# Altium schematic sheet DiffAmp_K-0.2.SchDoc
size A3; SheetNumber: 5; SheetTotal: 8
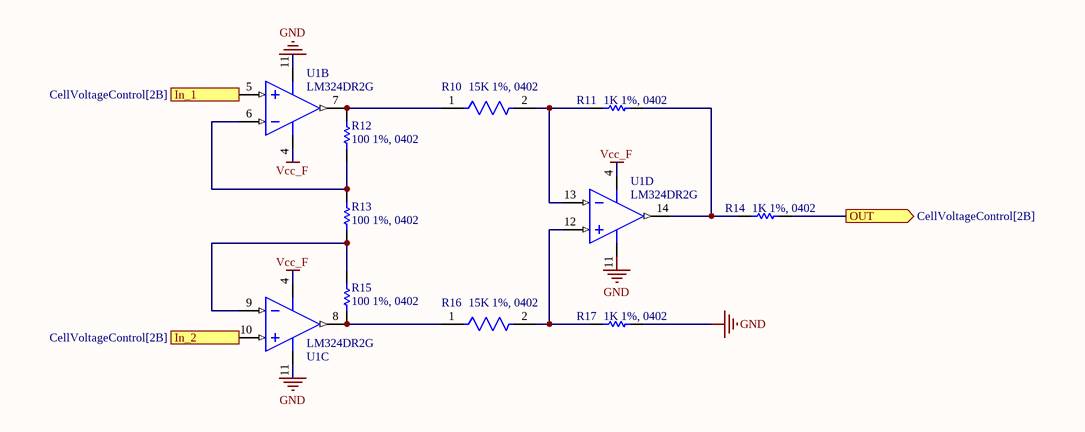
[diagram p0: DiffAmp_K-0.2.SchDoc]

## Parts
R10  15K 1%, 0402  [FP-ERJ2R-MFG]
R11  1K 1%, 0402  [RESC1005X40X25NL05T05]
R12  100 1%, 0402  [RESC1005X40X25LL05T05]
R13  100 1%, 0402  [RESC1005X40X25LL05T05]
R14  1K 1%, 0402  [RESC1005X40X25NL05T05]
R15  100 1%, 0402  [RESC1005X40X25LL05T05]
R16  15K 1%, 0402  [FP-ERJ2R-MFG]
R17  1K 1%, 0402  [RESC1005X40X25NL05T05]
U1  LM324DR2G  [ONSC-SOIC-14-751A-03_V]  (parts B,C,D of 4)

## Ports
In_1 (in, see CellVoltageControl[2B]), In_2 (in, see CellVoltageControl[2B]), OUT (out, see CellVoltageControl[2B])

## Nets
GND: R17.2 U1.11(VEE/GND)
Vcc_F: U1.4(VCC)
In_1: U1.5(IN2+) ; port In_1
In_2: U1.10(IN3+) ; port In_2
OUT: R14.2 ; port OUT
NetR10_1: R10.1 R12.2 U1.7(OUT2)
NetR10_2: R10.2 R11.1 U1.13(IN4-)
NetR11_2: R11.2 R14.1 U1.14(OUT4)
NetR12_1: R12.1 R13.2 U1.6(IN2-)
NetR13_1: R13.1 R15.2 U1.9(IN3-)
NetR15_1: R15.1 R16.1 U1.8(OUT3)
NetR16_2: R16.2 R17.1 U1.12(IN4+)

## Notes on the sheet
- Labels drawn without touching a wire or pin: GND

## Library data of the parts
R10 R16 = CMP-2002-00694-4: RES SMD 15K OHM 1% 1/10W 0402; Manufacturer Part Number: ERJ-2RKF1502X; Manufacturer: Panasonic; Automotive Grade: Grade 0; Voltage Rating: 50V; Resistance: 15kΩ; Temperature Coefficient: 100ppm/°C; Power Rating: 0.1W; Value: 15kΩ; ComponentLink2URL: https://industrial.panasonic.com/cdbs/www-data/pdf/RDA0000/AOA0000C304.pdf; Automotive: Yes; Temperature: -55°C to +155°C; Height: 0.4mm; Digikey Description: RES SMD 15K OHM 1% 1/10W 0402; Category: Res; Device Class L2: Resistors; Device Class L1: Passive Components; Package: ERJ2R; Temperature Range Low: -55°C; Tolerance: 1%; Series: ERJ; Footprint Url: https://b2b-api.panasonic.eu/file_stream/pids/fileversion/1180; Mouser Description: Res Thick Film 1.0 x 0.5 mm 15K Ohm 1% 0.1W(1/10W) 100ppm/ C Molded SMD Punched Carrier T/R; Composition: Thick Film; Lead Free: Yes; Device Class L3: Chip SMD Resistors; Octopart: https://octopart.com/erj-2rkf1502x-panasonic-55404985; RoHS: TRUE; Temperature Range High: +155°C; ComponentLink2Description: Datasheet
R11 R14 R17 = CMP-1011-00510-4: Chip Resistor, 1 KOhm, +/- 1%, 100 mW, -55 to 155 degC, 0402 (1005 Metric), RoHS, Tape and Reel; PartNumber: ERJ-2RKF1001X; Manufacturer: Basic Passives; Voltage Rating: 50 V; Case\/Package: 0402; Resistance: 1 KOhm; Power Rating: 100 mW; DatasheetVersion: 04/2015; Radiation Hardening: No; Pins: 2; Height: 0.35 mm; RoHSCompliant: true; Case Code (Imperial): 0402; ComponentLink2Description: Datasheet; ComponentLink1Description: Manufacturer URL; PackageReference: 0402; Mount: Surface Mount; Package Quantity: 10000; Tolerance: 1%; ComponentLink1URL: http://www.panasonic.com/; PackageDescription: 2-Pin Surface Mount Device, Body 1 x 0.5 mm; Mounting Technology: Surface Mount; Case Code (Metric): 1005; ComponentLink2URL: http://industrial.panasonic.com/cdbs/www-data/pdf/RDA0000/AOA0000C86.pdf; REACH SVHC: Yes; Packaging: Tape and Reel; Max Operating Temperature: 155 degC; Min Operating Temperature: -55 degC; Width: 0.5 mm; Length: 1 mm
R12 R13 R15 = CMP-2002-00605-3: Chip Resistor, 100 Ohm, +/- 1%, 100 mW, -55 to 155 degC, 0402 (1005 Metric), RoHS, Tape and Reel; Manufacturer: Basic Passives; PartNumber: ERJ-2RKF1000X; Power Rating: 100 mW; Resistance: 100 Ohm; Voltage Rating: 50 V; Case\/Package: 0402; Width: 0.5 mm; Pins: 2; ComponentLink2Description: Datasheet; PackageReference: 0402; Height: 0.35 mm; Tolerance: 1%; DatasheetVersion: 04/2015; Case Code (Imperial): 0402; Min Operating Temperature: -55 degC; Radiation Hardening: No; Length: 1 mm; Package Quantity: 10000; PackageDescription: 2-Pin Surface Mount Device, Body 1 x 0.5 mm; Mounting Technology: Surface Mount; Case Code (Metric): 1005; Packaging: Tape and Reel; ComponentLink1URL: http://www.panasonic.com/; RoHSCompliant: true; Max Operating Temperature: 155 degC; REACH SVHC: Yes; ComponentLink1Description: Manufacturer URL; ComponentLink2URL: http://industrial.panasonic.com/cdbs/www-data/pdf/RDA0000/AOA0000C86.pdf; Mount: Surface Mount
U1 = CMP-1310-00171-1: Single Supply Quad Operational Amplifier, 3 to 32 V, 0 to 70 degC, 14-Pin SOIC, Pb-Free, Tape and Reel; Manufacturer: On Semiconductor; VCC Max (V): 32; VCC Min (V): 3; PackageVersion: Rev. K, 05/2011; ComponentLink3URL: http://www.onsemi.com/pub_link/Collateral/751A-03.PDF; ComponentLink3Description: Package Specification; Packing: Tape and Reel; ComponentLink2URL: http://www.onsemi.cn/pub_link/Collateral/LM324-D.PDF; PackageReference: SOIC-14-751A-03; ComponentLink1URL: http://www.onsemi.com/; PackageDescription: 14-Pin Small Outline Integrated Circuit, Body 8.65 x 3.9 mm, Pitch 1.27 mm; ComponentLink1Description: Manufacturer URL; DatasheetVersion: Rev. 25; Mounting Technology: Surface Mount; RoHS: TRUE; ComponentLink2Description: Datasheet; PartNumber: LM324DR2G